# Altium project PCB_Project.PrjPcb
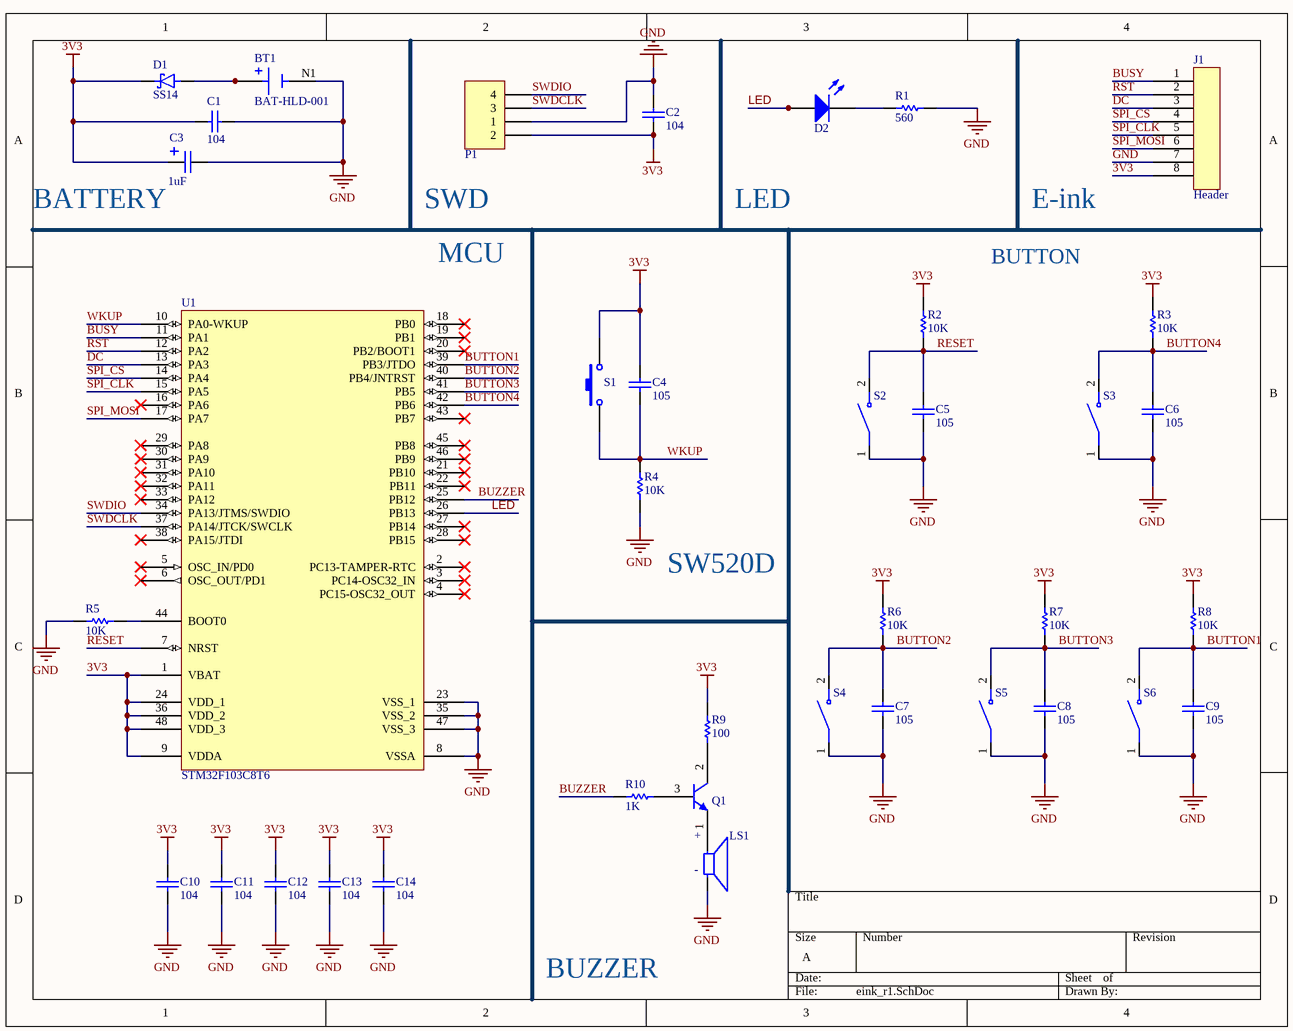
[diagram p0: eink_r1.SchDoc]
1 sheet, 38 parts. Net scope: global (net labels, ports and power ports of the same name join across sheets).
Board file: eink_r1.PcbDoc

## Sheet eink_r1.SchDoc
size A; SheetNumber: 1; SheetTotal: 1

### Parts
BT1  BAT-HLD-001  [BAT_BAT-HLD-001]
C1  value 104  [CAP-SM-0603]  (hidden comment: Cap Non-Pol SMD)
C2  value 104  [CAP-SM-0603]  (hidden comment: Cap Non-Pol SMD)
C3  value 1uF  [CAPMP3216X18N]  (hidden comment: Tantalum Capacitor)
C4  value 105  [CAP-SM-0603]  (hidden comment: Cap Non-Pol SMD)
C5  value 105  [CAP-SM-0603]  (hidden comment: Cap Non-Pol SMD)
C6  value 105  [CAP-SM-0603]  (hidden comment: Cap Non-Pol SMD)
C7  value 105  [CAP-SM-0603]  (hidden comment: Cap Non-Pol SMD)
C8  value 105  [CAP-SM-0603]  (hidden comment: Cap Non-Pol SMD)
C9  value 105  [CAP-SM-0603]  (hidden comment: Cap Non-Pol SMD)
C10  value 104  [CAP-SM-0603]  (hidden comment: Cap Non-Pol SMD)
C11  value 104  [CAP-SM-0603]  (hidden comment: Cap Non-Pol SMD)
C12  value 104  [CAP-SM-0603]  (hidden comment: Cap Non-Pol SMD)
C13  value 104  [CAP-SM-0603]  (hidden comment: Cap Non-Pol SMD)
C14  value 104  [CAP-SM-0603]  (hidden comment: Cap Non-Pol SMD)
D1  SS14  [DIOM4325X250N]
D2  LED SMD  [LED_0603_Blue]  (value not drawn)
J1  Header  [PCBComponent_1]
LS1  CMT-0926-86-SMT-TR  [XDCR_CMT-0926-86-SMT-TR]  (value not drawn)
P1  Header 4H  [JP4H]  (value not drawn)
Q1  C1815  [SOT23B]  (value not drawn)
R1  value 560  [RES-SM-0603]  (hidden comment: RESISTOR SMD)
R2  value 10K  [RES-SM-0603]  (hidden comment: RESISTOR SMD)
R3  value 10K  [RES-SM-0603]  (hidden comment: RESISTOR SMD)
R4  value 10K  [RES-SM-0603]  (hidden comment: RESISTOR SMD)
R5  value 10K  [RES-SM-0603]  (hidden comment: RESISTOR SMD)
R6  value 10K  [RES-SM-0603]  (hidden comment: RESISTOR SMD)
R7  value 10K  [RES-SM-0603]  (hidden comment: RESISTOR SMD)
R8  value 10K  [RES-SM-0603]  (hidden comment: RESISTOR SMD)
R9  value 100  [RES-SM-0603]  (hidden comment: RESISTOR SMD)
R10  value 1K  [RES-SM-0603]  (hidden comment: RESISTOR SMD)
S1  Tact SW - 2Pin  [SW2]  (value not drawn)
S2  PTS636_SM43J_SMTR_LFS  [SW_PTS636_SM43J_SMTR_LFS]  (value not drawn)
S3  PTS636_SM43J_SMTR_LFS  [SW_PTS636_SM43J_SMTR_LFS]  (value not drawn)
S4  PTS636_SM43J_SMTR_LFS  [SW_PTS636_SM43J_SMTR_LFS]  (value not drawn)
S5  PTS636_SM43J_SMTR_LFS  [SW_PTS636_SM43J_SMTR_LFS]  (value not drawn)
S6  PTS636_SM43J_SMTR_LFS  [SW_PTS636_SM43J_SMTR_LFS]  (value not drawn)
U1  STM32F103C8T6  [TSQFP50P900X900X160-48N]

### Nets
3V3: C1.2 C2.2 C3.1 C4.2 C10.2 C11.2 C12.2 C13.2 C14.2 D1.C(K) J1.8 P1.2 R2.2 R3.2 R6.2 R7.2 R8.2 R9.2 S1.2 U1.1(VBAT) U1.9(VDDA) U1.24(VDD_1) U1.36(VDD_2) U1.48(VDD_3)
GND: BT1.N1(NEG) C1.1 C2.1 C3.2 C5.1 C6.1 C7.1 C8.1 C9.1 C10.1 C11.1 C12.1 C13.1 C14.1 J1.7 LS1.N P1.1 R1.2 R4.1 R5.2 S2.1(COM) S3.1(COM) S4.1(COM) S5.1(COM) S6.1(COM) U1.8(VSSA) U1.23(VSS_1) U1.35(VSS_2) U1.47(VSS_3)
BUSY: J1.1 U1.11(PA1)
BUTTON1: C9.2 R8.1 S6.2(NO) U1.39(PB3/JTDO)
BUTTON2: C7.2 R6.1 S4.2(NO) U1.40(PB4/JNTRST)
BUTTON3: C8.2 R7.1 S5.2(NO) U1.41(PB5)
BUTTON4: C6.2 R3.1 S3.2(NO) U1.42(PB6)
BUZZER: R10.1 U1.25(PB12)
DC: J1.3 U1.13(PA3)
LED: D2.1(A) U1.26(PB13)
RESET: C5.2 R2.1 S2.2(NO) U1.7(NRST)
RST: J1.2 U1.12(PA2)
SPI_CLK: J1.5 U1.15(PA5)
SPI_CS: J1.4 U1.14(PA4)
SPI_MOSI: J1.6 U1.17(PA7)
SWDCLK: P1.3 U1.37(PA14/JTCK/SWCLK)
SWDIO: P1.4 U1.34(PA13/JTMS/SWDIO)
WKUP: C4.1 R4.2 S1.1 U1.10(PA0-WKUP)
NetBT1_P1: BT1.P1(POS) BT1.P2(POS) D1.A
NetD2_2: D2.2(K) R1.1
NetLS1_P: LS1.P Q1.1(E)
NetQ1_2: Q1.2(C) R9.1
NetQ1_3: Q1.3(B) R10.2
NetR5_1: R5.1 U1.44(BOOT0)

Not connected (* = marked no-connect by the designer): U1 2(PC13-TAMPER-RTC)* 3(PC14-OSC32_IN)* 4(PC15-OSC32_OUT)* 5(OSC_IN/PD0)* 6(OSC_OUT/PD1)* 16(PA6)* 18(PB0)* 19(PB1)* 20(PB2/BOOT1)* 21(PB10)* 22(PB11)* 27(PB14)* 28(PB15)* 29(PA8)* 30(PA9)* 31(PA10)* 32(PA11)* 33(PA12)* 38(PA15/JTDI)* 43(PB7)* 45(PB8)* 46(PB9)*

### Notes on the sheet
- BATTERY
- SWD
- LED
- E-ink
- MCU
- BUTTON
- SW520D
- BUZZER
- (in symbol CMT-0926-86-SMT-TR) +; -

### Library data of the parts
BT1 = BAT-HLD-001: Battery Retainer Coin, 20.0mm 1 Cell SMD (SMT) Tab; Value: *; MP: BAT-HLD-001; Package: None; Availability: Unavailable; Price: None
C1 C2 C4-C14 = Cap Non-Pol SMD: Capacitor
D2 = LED SMD: LED
J1 = Header: XH 2.54mm PCB Header 8 Pin SMD Horizontal
P1 = Header 4H: Header, 4-Pin, Right Angle; LatestRevisionDate: 17-Jul-2002; LatestRevisionNote: Re-released for DXP Platform.; Publisher: Altium Limited
Q1 = C1815: NPN Bipolar Transistor
R1-R10 = RESISTOR SMD: Resistor
S1 = Tact SW - 2Pin: Switch button 2 pin
S2-S6 = PTS636_SM43J_SMTR_LFS: Tactile Switch SPST-NO Top Actuated Surface Mount; Price: None; Value: *; MP: PTS636_SM43J_SMTR_LFS; Package: None; Availability: Unavailable
U1 = STM32F103C8T6: Manufacturer: ST; ComponentLink1Description: Supplier 1 Link
D1 = SS14: Value: *; Availability: Unavailable; Price: None; Package: None; MP: SS14
LS1 = CMT-0926-86-SMT-TR: MP: CMT-0926-86-SMT-TR; Availability: Unavailable; Package: None; Value: *; Price: None